# Altium project Photomodule.PrjPCB
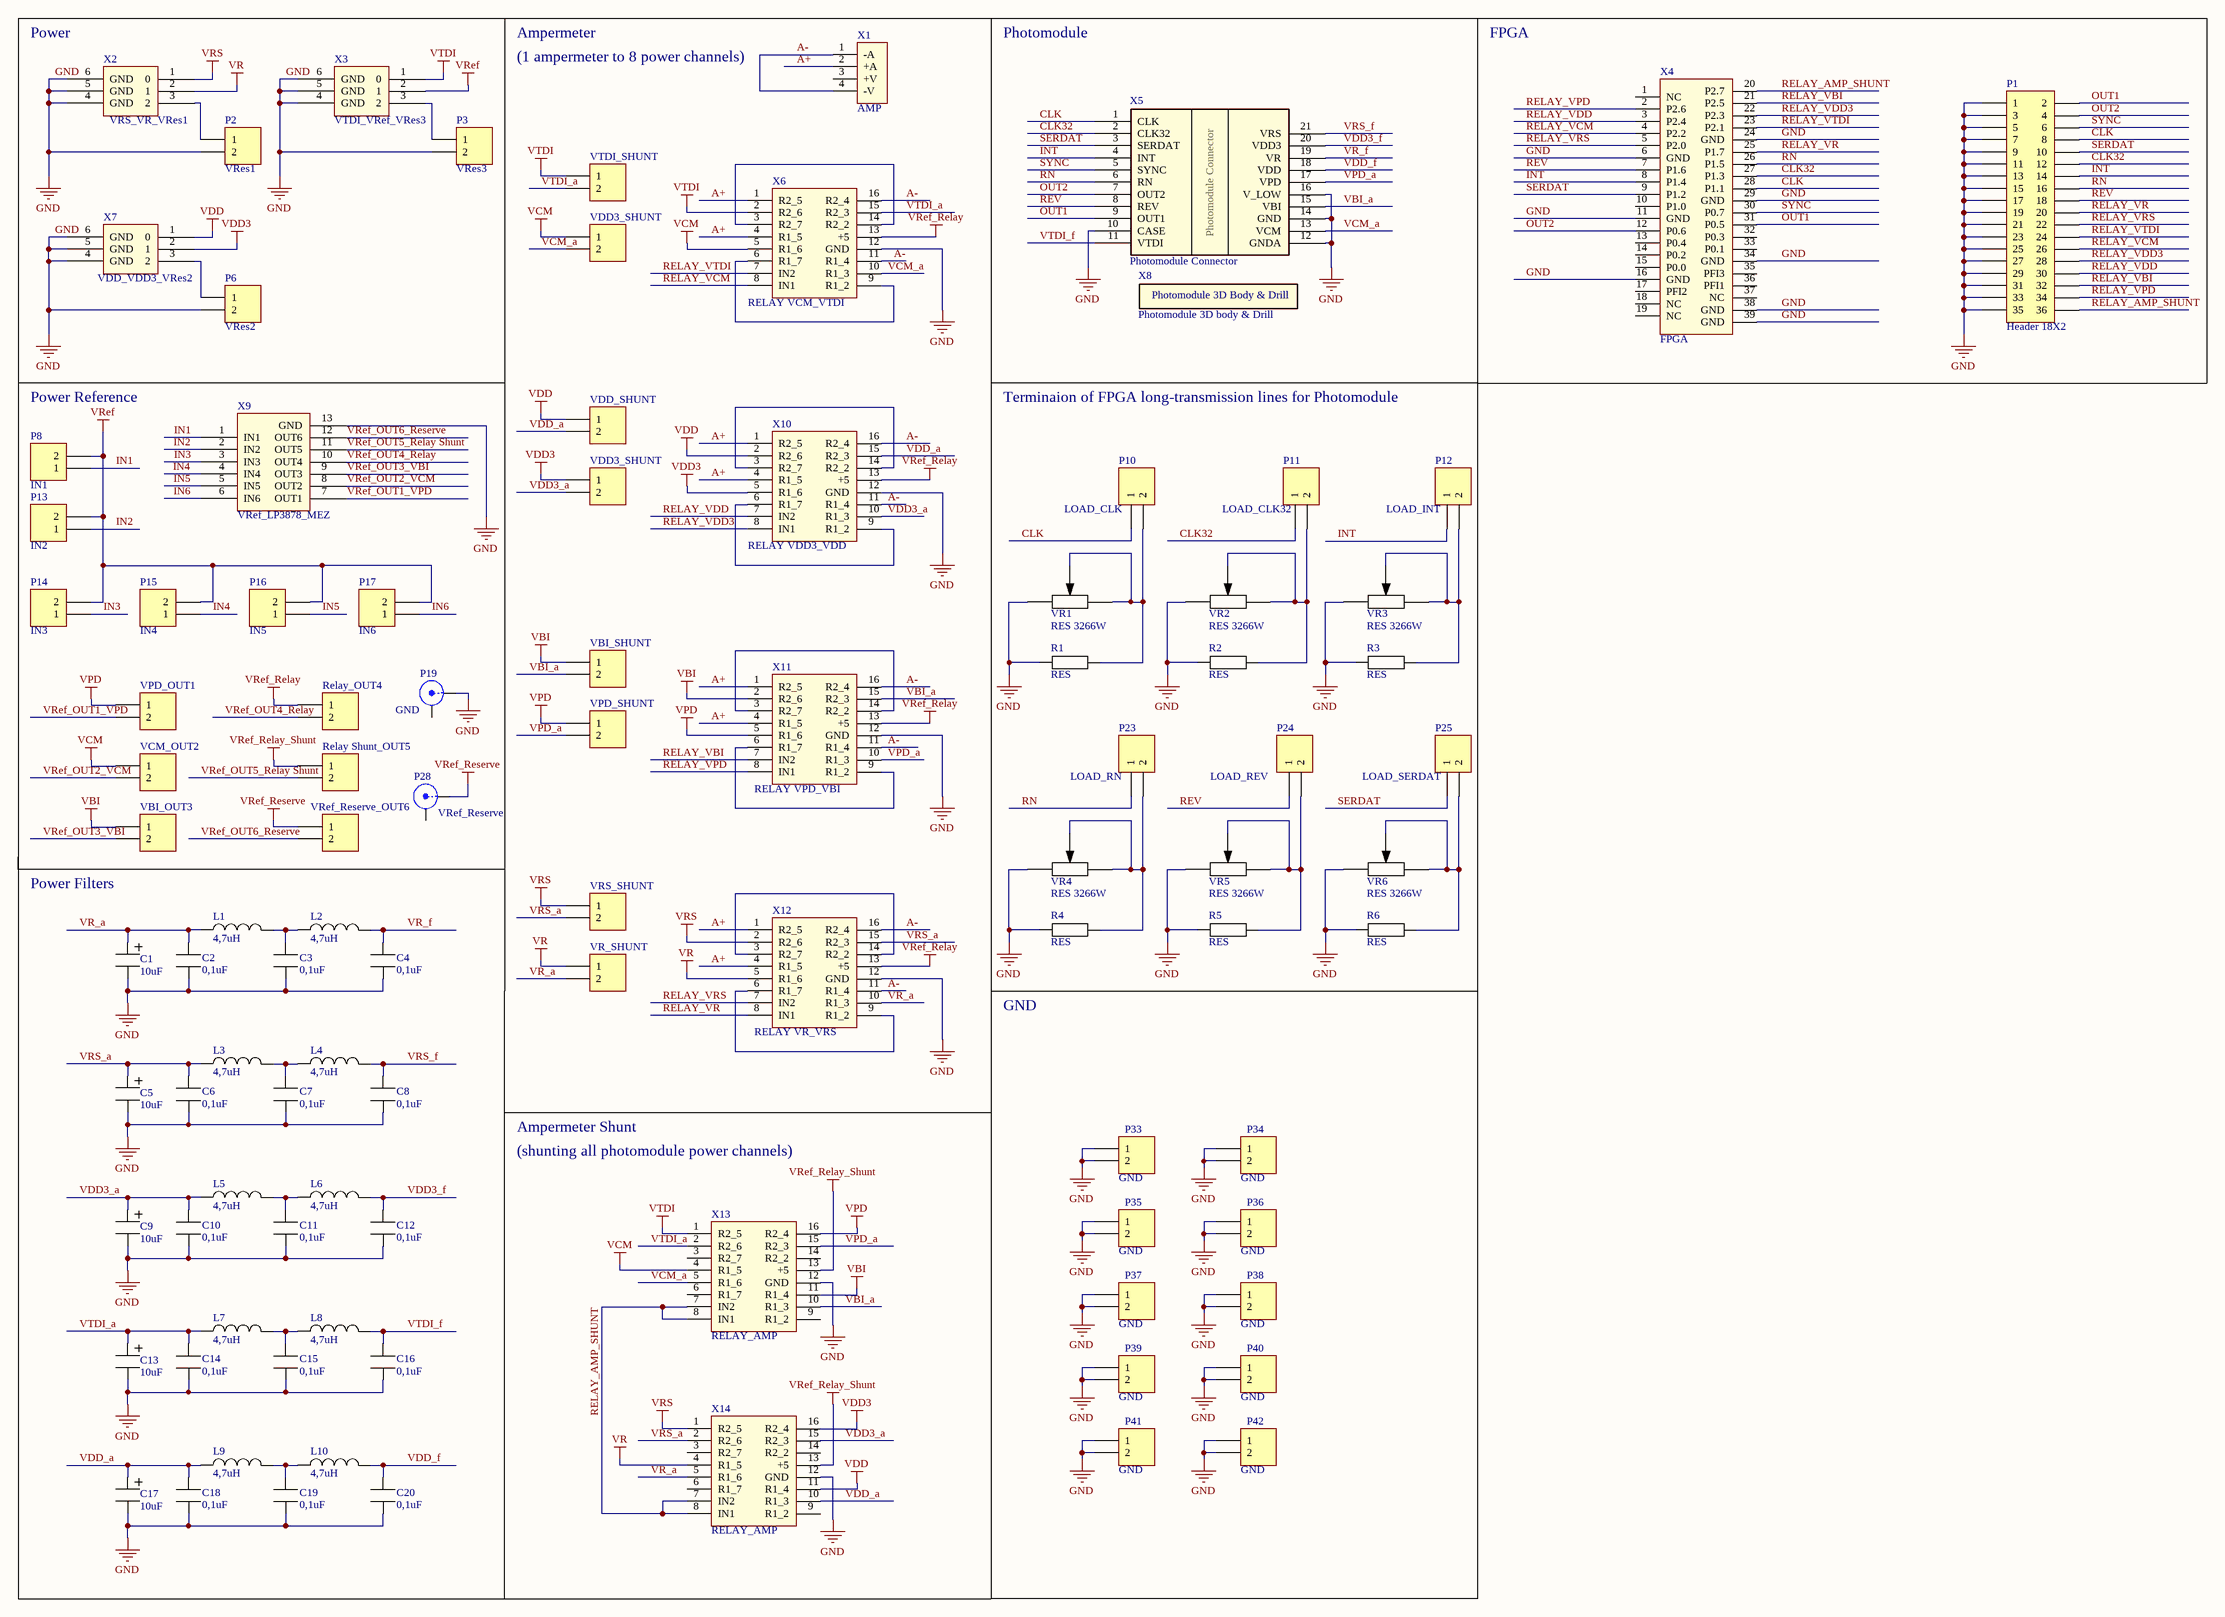
[diagram p0: Photomodule.SchDoc]
1 sheet, 98 parts. Net scope: global (net labels, ports and power ports of the same name join across sheets).
Board file: Photomodule.PcbDoc

## Sheet Photomodule.SchDoc
size A2; Address1: Address1; Address2: Address2; Address3: Address3; Address4: Address4; DocumentNumber: АБВГ.123456.001 Э3; SheetNumber: 1; Scale: 1:1; DocumentType: Схема электрическая принципиальная; FirstReferrence: АБВГ.123456.001

### Parts
C1  10uF  [CAP_TANT_TypeC]
C2  0,1uF  [CAP_0603]
C3  0,1uF  [CAP_0603]
C4  0,1uF  [CAP_0603]
C5  10uF  [CAP_TANT_TypeC]
C6  0,1uF  [CAP_0603]
C7  0,1uF  [CAP_0603]
C8  0,1uF  [CAP_0603]
C9  10uF  [CAP_TANT_TypeC]
C10  0,1uF  [CAP_0603]
C11  0,1uF  [CAP_0603]
C12  0,1uF  [CAP_0603]
C13  10uF  [CAP_TANT_TypeC]
C14  0,1uF  [CAP_0603]
C15  0,1uF  [CAP_0603]
C16  0,1uF  [CAP_0603]
C17  10uF  [CAP_TANT_TypeC]
C18  0,1uF  [CAP_0603]
C19  0,1uF  [CAP_0603]
C20  0,1uF  [CAP_0603]
L1  4,7uH  [IND_2520]
L2  4,7uH  [IND_2520]
L3  4,7uH  [IND_2520]
L4  4,7uH  [IND_2520]
L5  4,7uH  [IND_2520]
L6  4,7uH  [IND_2520]
L7  4,7uH  [IND_2520]
L8  4,7uH  [IND_2520]
L9  4,7uH  [IND_2520]
L10  4,7uH  [IND_2520]
P1  Header 18X2  [HDR2X18]
P2  VRes1  [HDR1X2]
P3  VRes3  [HDR1X2]
P4  VTDI_SHUNT  [HDR1X2]
P5  VDD3_SHUNT  [HDR1X2]
P6  VRes2  [HDR1X2]
P7  VDD_SHUNT  [HDR1X2]
P8  IN1  [HDR1X2]
P9  VDD3_SHUNT  [HDR1X2]
P10  LOAD_CLK  [HDR1X2]
P11  LOAD_CLK32  [HDR1X2]
P12  LOAD_INT  [HDR1X2]
P13  IN2  [HDR1X2]
P14  IN3  [HDR1X2]
P15  IN4  [HDR1X2]
P16  IN5  [HDR1X2]
P17  IN6  [HDR1X2]
P18  VBI_SHUNT  [HDR1X2]
P19  GND  [BNC_RA CON]
P20  VPD_OUT1  [HDR1X2]
P21  Relay_OUT4  [HDR1X2]
P22  VPD_SHUNT  [HDR1X2]
P23  LOAD_RN  [HDR1X2]
P24  LOAD_REV  [HDR1X2]
P25  LOAD_SERDAT  [HDR1X2]
P26  VCM_OUT2  [HDR1X2]
P27  Relay Shunt_OUT5  [HDR1X2]
P28  VRef_Reserve  [BNC_RA CON]
P29  VBI_OUT3  [HDR1X2]
P30  VRef_Reserve_OUT6  [HDR1X2]
P31  VRS_SHUNT  [HDR1X2]
P32  VR_SHUNT  [HDR1X2]
P33  GND  [HDR1X2]
P34  GND  [HDR1X2]
P35  GND  [HDR1X2]
P36  GND  [HDR1X2]
P37  GND  [HDR1X2]
P38  GND  [HDR1X2]
P39  GND  [HDR1X2]
P40  GND  [HDR1X2]
P41  GND  [HDR1X2]
P42  GND  [HDR1X2]
R1  RES  [RES_0805]
R2  RES  [RES_0805]
R3  RES  [RES_0805]
R4  RES  [RES_0805]
R5  RES  [RES_0805]
R6  RES  [RES_0805]
VR1  RES 3266W  [RES 3266W]
VR2  RES 3266W  [RES 3266W]
VR3  RES 3266W  [RES 3266W]
VR4  RES 3266W  [RES 3266W]
VR5  RES 3266W  [RES 3266W]
VR6  RES 3266W  [RES 3266W]
X1  AMP  [AMP_VOLTMETR]
X2  VRS_VR_VRes1  [POWER]
X3  VTDI_VRef_VRes3  [POWER]
X4  FPGA  [CHEAP_CONN_FEMALE]
X5  Photomodule Connector  [Photomodule_Electric]
X6  RELAY VCM_VTDI  [RELAY_MODULE]
X7  VDD_VDD3_VRes2  [POWER]
X8  Photomodule 3D body & Drill  [Photomodule_3D Body & Drill]
X9  VRef_LP3878_MEZ  [VRef_LP3878_MEZ]
X10  RELAY VDD3_VDD  [RELAY_MODULE]
X11  RELAY VPD_VBI  [RELAY_MODULE]
X12  RELAY VR_VRS  [RELAY_MODULE]
X13  RELAY_AMP  [RELAY_MODULE]
X14  RELAY_AMP  [RELAY_MODULE]

### Nets
GND: C1.2 C2.1 C3.1 C4.1 C5.2 C6.1 C7.1 C8.1 C9.2 C10.1 C11.1 C12.1 C13.2 C14.1 C15.1 C16.1 C17.2 C18.1 C19.1 C20.1 P1.1 P1.3 P1.5 P1.7 P1.9 P1.11 P1.13 P1.15 P1.17 P1.19 P1.21 P1.23 P1.25 P1.27 P1.29 P1.31 P1.33 P1.35 P2.2 P3.2 P6.2 P19.1(X) P33.1 P33.2 P34.1 P34.2 P35.1 P35.2 P36.1 P36.2 P37.1 P37.2 P38.1 P38.2 P39.1 P39.2 P40.1 P40.2 P41.1 P41.2 P42.1 P42.2 R1.1 R2.1 R3.1 R4.1 R5.1 R6.1 VR1.1 VR2.1 VR3.1 VR4.1 VR5.1 VR6.1 X2.4(GND) X2.5(GND) X2.6(GND) X3.4(GND) X3.5(GND) X3.6(GND) X4.6(GND) X4.11(GND) X4.16(GND) X4.24(GND) X4.29(GND) X4.34(GND) X4.38(GND) X4.39(GND) X5.10(CASE) X5.12(GNDA) X5.14(GND) X5.16(V_LOW) X6.12(GND) X7.4(GND) X7.5(GND) X7.6(GND) X9.13(GND) X10.12(GND) X11.12(GND) X12.12(GND) X13.12(GND) X14.12(GND)
VBI: P18.1 P29.1 X11.2(R2_6) X13.11(R1_4)
VCM: P5.1 P26.1 X6.5(R1_6) X13.4(R1_5)
VDD: P7.1 X7.1(0) X10.2(R2_6) X14.11(R1_4)
VDD3: P9.1 X7.2(1) X10.5(R1_6) X14.16(R2_4)
VPD: P20.1 P22.1 X11.5(R1_6) X13.16(R2_4)
VR: P32.1 X2.2(1) X12.5(R1_6) X14.4(R1_5)
VRef: P8.2 P13.2 P14.2 P15.2 P16.2 P17.2 X3.2(1)
VRef_Relay: P21.1 X6.13(+5) X10.13(+5) X11.13(+5) X12.13(+5)
VRef_Relay_Shunt: P27.1 X13.13(+5) X14.13(+5)
VRef_Reserve: P28.1(X) P30.1
VRS: P31.1 X2.1(0) X12.2(R2_6) X14.1(R2_5)
VTDI: P4.1 X3.1(0) X6.2(R2_6) X13.1(R2_5)
A+: X1.2(+A) X6.1(R2_5) X6.4(R1_5) X10.1(R2_5) X10.4(R1_5) X11.1(R2_5) X11.4(R1_5) X12.1(R2_5) X12.4(R1_5)
A-: X1.1(-A) X1.4(-V) X6.11(R1_4) X6.16(R2_4) X10.11(R1_4) X10.16(R2_4) X11.11(R1_4) X11.16(R2_4) X12.11(R1_4) X12.16(R2_4)
CLK: P1.8 P10.1 X4.28(P1.1) X5.1(CLK)
CLK32: P1.12 P11.1 X4.27(P1.3) X5.2(CLK32)
IN1: P8.1 X9.1(IN1)
IN2: P13.1 X9.2(IN2)
IN3: P14.1 X9.3(IN3)
IN4: P15.1 X9.4(IN4)
IN5: P16.1 X9.5(IN5)
IN6: P17.1 X9.6(IN6)
INT: P1.14 P12.1 X4.8(P1.4) X5.4(INT)
OUT1: P1.2 X4.31(P0.5) X5.9(OUT1)
OUT2: P1.4 X4.12(P0.6) X5.7(OUT2)
RELAY_AMP_SHUNT: P1.36 X4.20(P2.7) X13.7(IN2) X13.8(IN1) X14.7(IN2) X14.8(IN1)
RELAY_VBI: P1.32 X4.21(P2.5) X11.7(IN2)
RELAY_VCM: P1.26 X4.4(P2.2) X6.8(IN1)
RELAY_VDD: P1.30 X4.3(P2.4) X10.7(IN2)
RELAY_VDD3: P1.28 X4.22(P2.3) X10.8(IN1)
RELAY_VPD: P1.34 X4.2(P2.6) X11.8(IN1)
RELAY_VR: P1.20 X4.25(P1.7) X12.8(IN1)
RELAY_VRS: P1.22 X4.5(P2.0) X12.7(IN2)
RELAY_VTDI: P1.24 X4.23(P2.1) X6.7(IN2)
REV: P1.18 P24.1 X4.7(P1.6) X5.8(REV)
RN: P1.16 P23.1 X4.26(P1.5) X5.6(RN)
SERDAT: P1.10 P25.1 X4.9(P1.2) X5.3(SERDAT)
SYNC: P1.6 X4.30(P0.7) X5.5(SYNC)
VBI_a: P18.2 X5.15(VBI) X11.15(R2_3) X13.10(R1_3)
VCM_a: P5.2 X5.13(VCM) X6.10(R1_3) X13.5(R1_6)
VDD3_a: C9.1 C10.2 L5.1 P9.2 X10.10(R1_3) X14.15(R2_3)
VDD3_f: C12.2 L6.2 X5.20(VDD3)
VDD_a: C17.1 C18.2 L9.1 P7.2 X10.15(R2_3) X14.10(R1_3)
VDD_f: C20.2 L10.2 X5.18(VDD)
VPD_a: P22.2 X5.17(VPD) X11.10(R1_3) X13.15(R2_3)
VR_a: C1.1 C2.2 L1.1 P32.2 X12.10(R1_3) X14.5(R1_6)
VR_f: C4.2 L2.2 X5.19(VR)
VRef_OUT1_VPD: P20.2 X9.7(OUT1)
VRef_OUT2_VCM: P26.2 X9.8(OUT2)
VRef_OUT3_VBI: P29.2 X9.9(OUT3)
VRef_OUT4_Relay: P21.2 X9.10(OUT4)
VRef_OUT5_Relay Shunt: P27.2 X9.11(OUT5)
VRef_OUT6_Reserve: P30.2 X9.12(OUT6)
VRS_a: C5.1 C6.2 L3.1 P31.2 X12.15(R2_3) X14.2(R2_6)
VRS_f: C8.2 L4.2 X5.21(VRS)
VTDI_a: C13.1 C14.2 L7.1 P4.2 X6.15(R2_3) X13.2(R2_6)
VTDI_f: C16.2 L8.2 X5.11(VTDI)
NetC3_2: C3.2 L1.2 L2.1
NetC7_2: C7.2 L3.2 L4.1
NetC11_2: C11.2 L5.2 L6.1
NetC15_2: C15.2 L7.2 L8.1
NetC19_2: C19.2 L9.2 L10.1
NetP2_1: P2.1 X2.3(2)
NetP3_1: P3.1 X3.3(2)
NetP6_1: P6.1 X7.3(2)
NetP10_2: P10.2 R1.2 VR1.2 VR1.3
NetP11_2: P11.2 R2.2 VR2.2 VR2.3
NetP12_2: P12.2 R3.2 VR3.2 VR3.3
NetP23_2: P23.2 R4.2 VR4.2 VR4.3
NetP24_2: P24.2 R5.2 VR5.2 VR5.3
NetP25_2: P25.2 R6.2 VR6.2 VR6.3
NetX6_3: X6.3(R2_7) X6.14(R2_2)
NetX6_6: X6.6(R1_7) X6.9(R1_2)
NetX10_3: X10.3(R2_7) X10.14(R2_2)
NetX10_6: X10.6(R1_7) X10.9(R1_2)
NetX11_3: X11.3(R2_7) X11.14(R2_2)
NetX11_6: X11.6(R1_7) X11.9(R1_2)
NetX12_3: X12.3(R2_7) X12.14(R2_2)
NetX12_6: X12.6(R1_7) X12.9(R1_2)

Not connected (* = marked no-connect by the designer): P19 2(Y); P28 2(Y); X1 3(+V); X4 1(NC) 10(P1.0) 13(P0.4) 14(P0.2) 15(P0.0) 17(PFI2) 18(NC) 19(NC) 32(P0.3) 33(P0.1) 35(PFI3) 36(PFI1) 37(NC); X13 3(R2_7) 6(R1_7) 9(R1_2) 14(R2_2); X14 3(R2_7) 6(R1_7) 9(R1_2) 14(R2_2)

### Notes on the sheet
- Power
- Ampermeter
- Photomodule
- FPGA
- (1 ampermeter to 8 power channels)
- Power Reference
- Terminaion of FPGA long-transmission lines for Photomodule
- Power Filters
- GND
- Ampermeter Shunt
- (shunting all photomodule power channels)
- Title
- Size:
- Date:
- File:
- A2
- Number:
- Time:
- Revision:
- Sheet
- of
- (in symbol Phoromodule 3D body & Drill) Photomodule 3D Body & Drill

### Library data of the parts
C1 C5 C9 C13 C17 = CAP_Tantalum
C2-C4 C6-C8 C10-C12 C14-C16 C18-C20 = CAP
L1-L10 = IND
P1 = Header 18X2: Header, 18-Pin, Dual row; LatestRevisionDate: 17-Jul-2002; LatestRevisionNote: Re-released for DXP Platform.; Publisher: Altium Limited
P2-P18 P20-P27 P29-P42 = Header 2: Header, 2-Pin; LatestRevisionDate: 17-Jul-2002; LatestRevisionNote: Re-released for DXP Platform.; Publisher: Altium Limited
P19 P28 = BNC: BNC Elbow Connector; LatestRevisionDate: 17-Jul-2002; LatestRevisionNote: Re-released for DXP Platform.; Publisher: Altium Limited
X1 = AMP_VOLTMETR
X2 X3 X7 = POWER
X4 = CHEAP_CON_37_FEMALE
X6 X10-X14 = MEZON_RELAY
X8 = Phoromodule 3D body & Drill